# EasyEDA schematic NanoEls.json
TITLE: github.com/kachurovskiy/nanoels/; REV: 1; Date: 2020-11-15; Sheet: 1/1
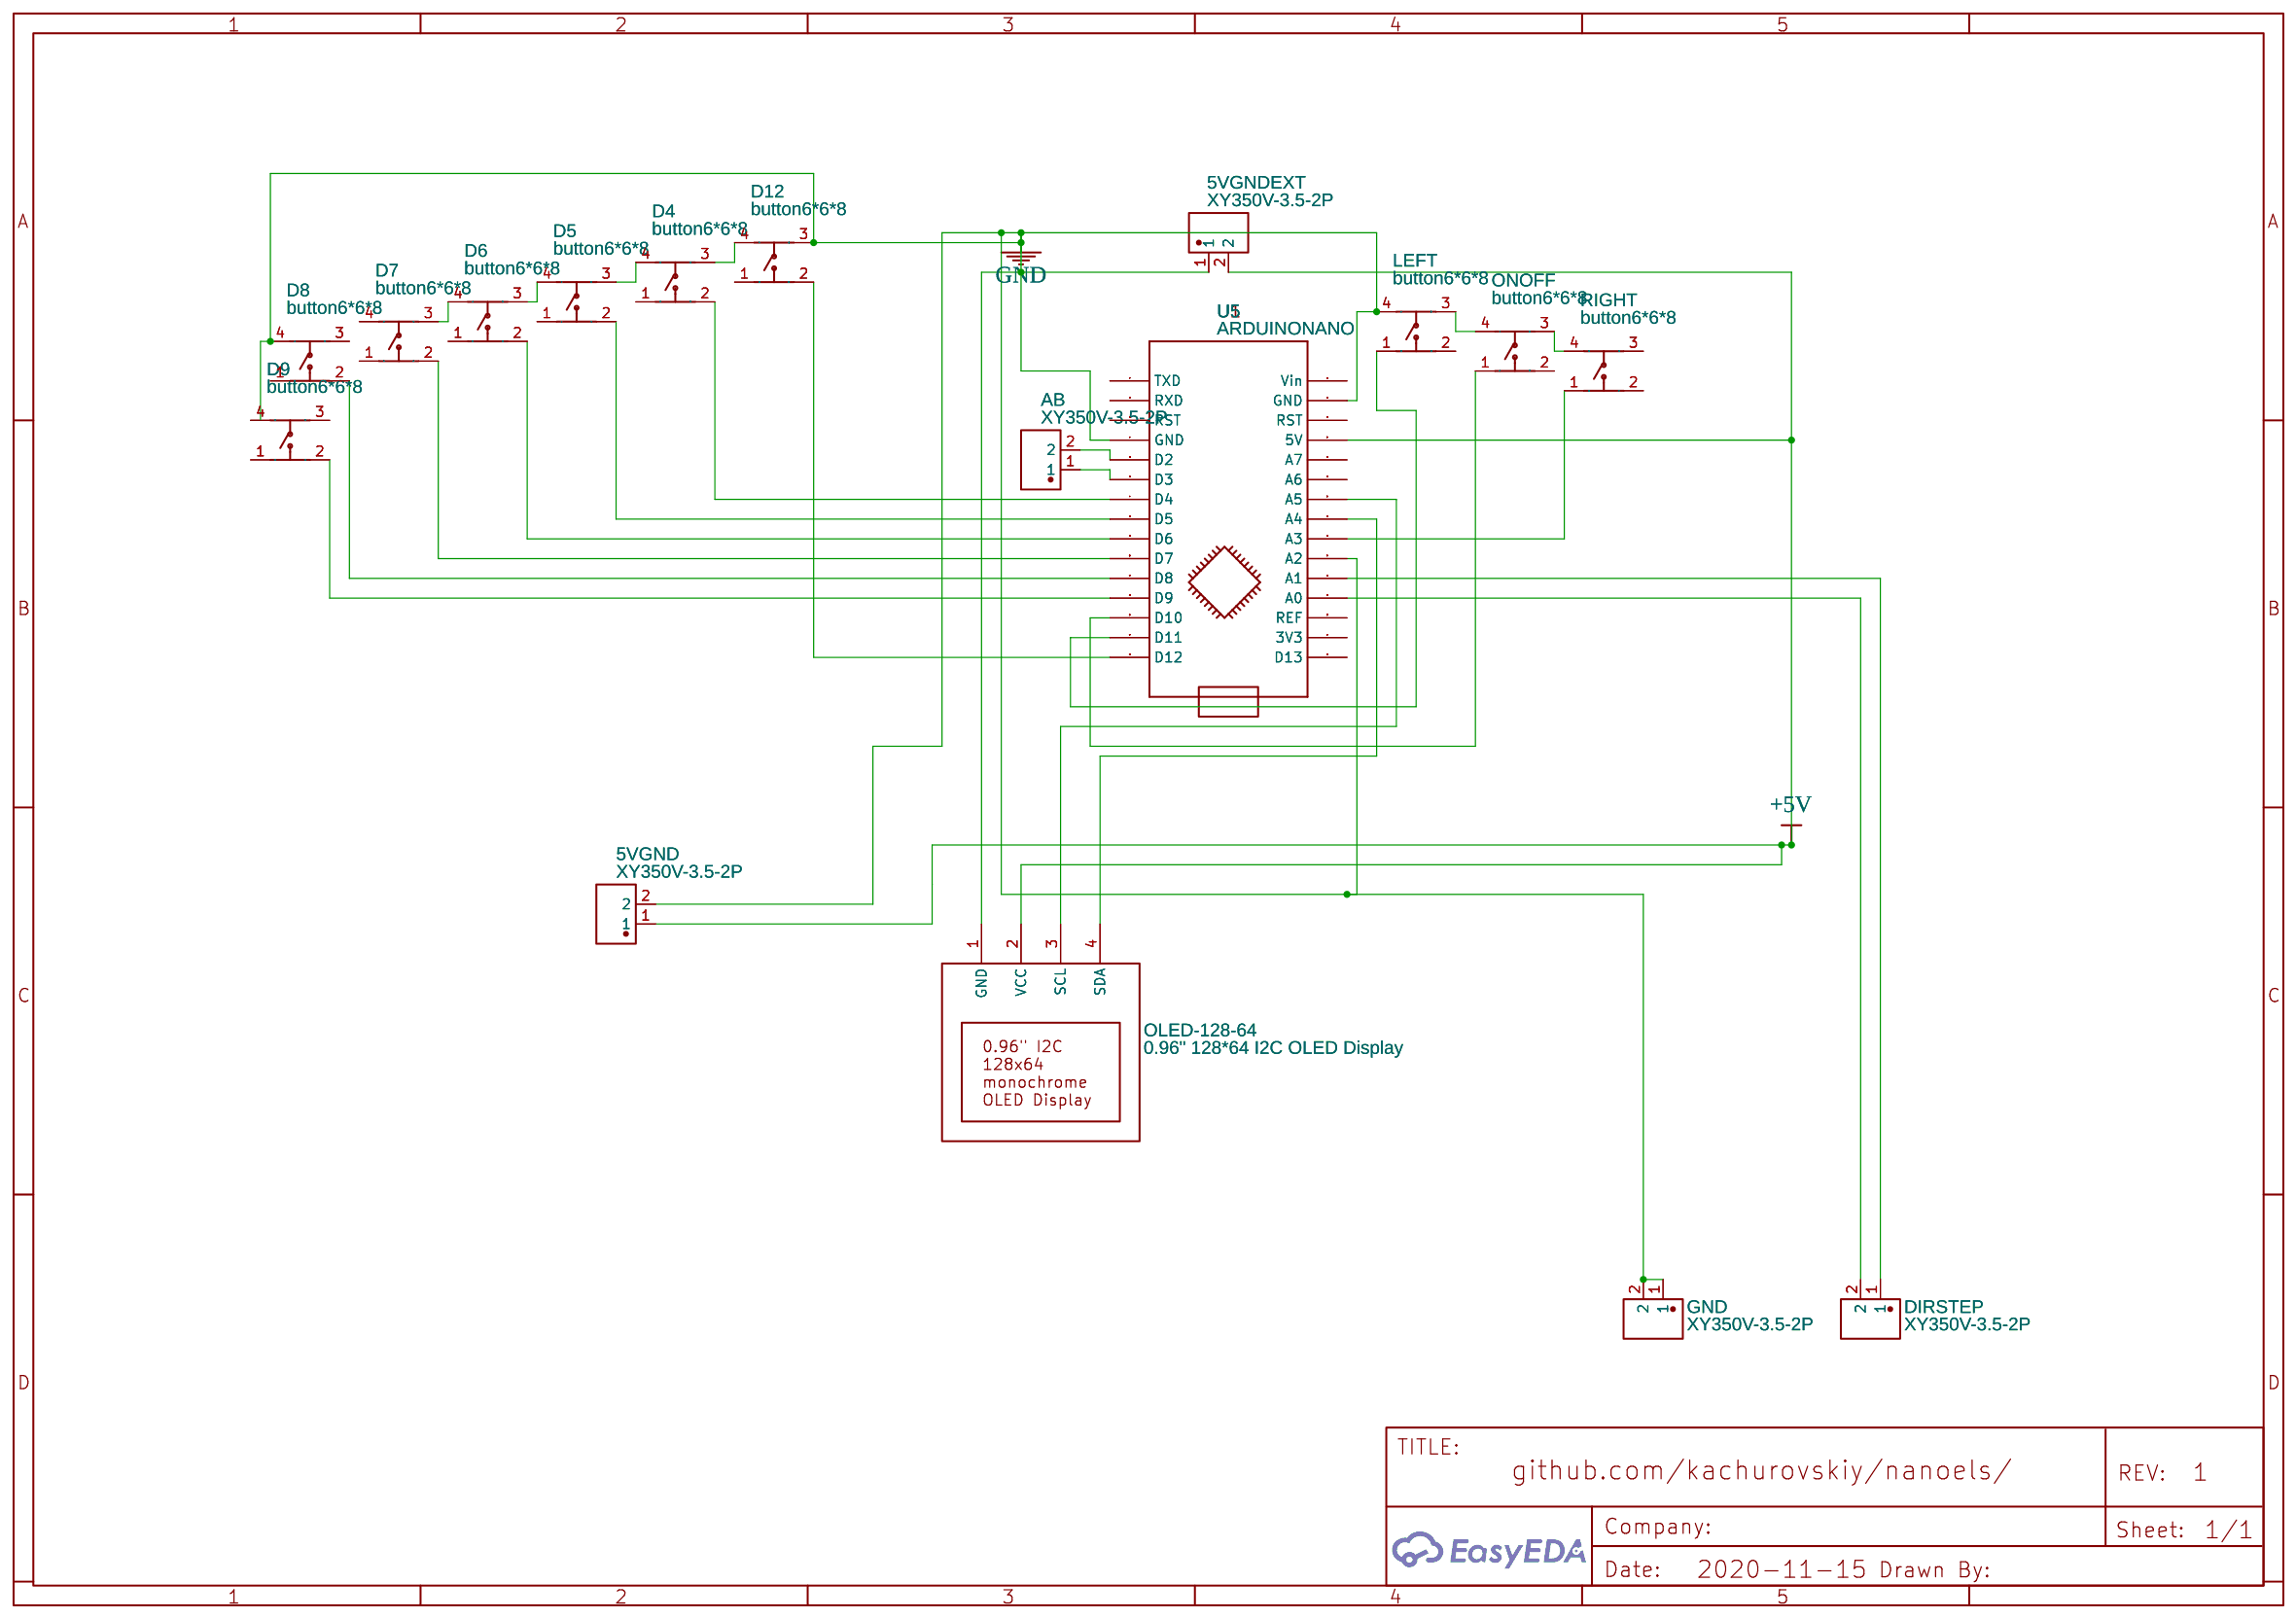
[diagram p0: schematic sheet]

## Parts
5VGND  XY350V-3.5-2P  [CONN-TH_XY350V-3.5-2P]
5VGNDEXT  XY350V-3.5-2P  [CONN-TH_XY350V-3.5-2P]
AB  XY350V-3.5-2P  [CONN-TH_XY350V-3.5-2P]
D4  button6*6*8  [KEY-TH_4P-L6.0-W6.0-P4.50-LS7.5]
D5  button6*6*8  [KEY-TH_4P-L6.0-W6.0-P4.50-LS7.5]
D6  button6*6*8  [KEY-TH_4P-L6.0-W6.0-P4.50-LS7.5]
D7  button6*6*8  [KEY-TH_4P-L6.0-W6.0-P4.50-LS7.5]
D8  button6*6*8  [KEY-TH_4P-L6.0-W6.0-P4.50-LS7.5]
D9  button6*6*8  [KEY-TH_4P-L6.0-W6.0-P4.50-LS7.5]
D12  button6*6*8  [KEY-TH_4P-L6.0-W6.0-P4.50-LS7.5]
DIRSTEP  XY350V-3.5-2P  [CONN-TH_XY350V-3.5-2P]
GND  XY350V-3.5-2P  [CONN-TH_XY350V-3.5-2P]
LEFT  button6*6*8  [KEY-TH_4P-L6.0-W6.0-P4.50-LS7.5]
OLED-128-64  0.96" 128*64 I2C OLED Display  [OLED12864_096I2C]
ONOFF  button6*6*8  [KEY-TH_4P-L6.0-W6.0-P4.50-LS7.5]
RIGHT  button6*6*8  [KEY-TH_4P-L6.0-W6.0-P4.50-LS7.5]
U5  ARDUINONANO  [ARDUINO_NANO1]

## Library data of the parts
5VGND 5VGNDEXT AB DIRSTEP GND = XY350V-3.5-2P: Supplier: LCSC; Supplier Part: C784942; Manufacturer: Ningbo Xinlaiya Elec.; Contributor: LCSC
D4-D9 D12 LEFT ONOFF RIGHT = button6*6*8: Supplier Part: C59982; Supplier: LCSC; Manufacturer: ReliaPro; image: http://image.lceda.cn/szlcsc/C59982.jpg
OLED-128-64 = 0.96" 128*64 I2C OLED Display: Contributor: fohengineer; sourceId: hdI0icuoG
U5 = ARDUINONANO: Manufacturer Part: arduino_nano1; Contributor: Michal Smetana

## Nets
+5V: 5VGND.1 5VGNDEXT.2 OLED-128-64.2(VCC) U5.27(5V)
GND: 5VGND.2 5VGNDEXT.1 D8.4 D9.4 D12.3 GND.1 GND.2 LEFT.4 OLED-128-64.1(GND) U5.4(GND) U5.21(A2) U5.29(GND)
AB_1: AB.1 U5.6(D3)
AB_2: AB.2 U5.5(D2)
D4_4: D4.4 D5.3
D5_4: D5.4 D6.3
D6_4: D6.4 D7.3
D12_4: D4.3 D12.4
DIRSTEP_1: DIRSTEP.1 U5.20(A1)
DIRSTEP_2: DIRSTEP.2 U5.19(A0)
LEFT_3: LEFT.3 ONOFF.4
ONOFF_3: ONOFF.3 RIGHT.4
U5_7: D4.2 U5.7(D4)
U5_8: D5.2 U5.8(D5)
U5_9: D6.2 U5.9(D6)
U5_10: D7.2 U5.10(D7)
U5_11: D8.2 U5.11(D8)
U5_12: D9.2 U5.12(D9)
U5_13: ONOFF.1 U5.13(D10)
U5_14: LEFT.1 U5.14(D11)
U5_15: D12.2 U5.15(D12)
U5_22: RIGHT.1 U5.22(A3)
U5_23: OLED-128-64.4(SDA) U5.23(A4)
U5_24: OLED-128-64.3(SCL) U5.24(A5)

Not connected (* = marked no-connect by the designer): D4 1; D5 1; D6 1; D7 1 4; D8 1 3; D9 1 3; D12 1; LEFT 2; ONOFF 2; RIGHT 2 3; U5 1(TXD) 2(RXD) 3(RST) 16(D13) 17(3V3) 18(REF) 25(A6) 26(A7) 28(RST) 30(Vin)
